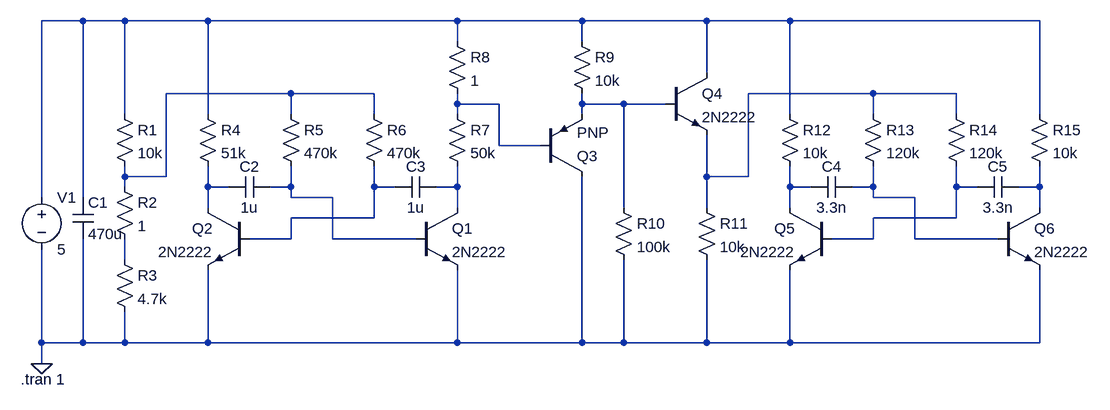
[diagram p0: schematic SimpleSynthesizer.asc]
SimpleSynthesizer.asc, the LTspice schematic file:
Version 4
SHEET 1 1784 680
WIRE 224 -80 160 -80
WIRE 288 -80 224 -80
WIRE 416 -80 288 -80
WIRE 800 -80 416 -80
WIRE 992 -80 800 -80
WIRE 1184 -80 992 -80
WIRE 1312 -80 1184 -80
WIRE 1696 -80 1312 -80
WIRE 800 -48 800 -80
WIRE 992 -48 992 -80
WIRE 1184 0 1184 -80
WIRE 544 32 352 32
WIRE 672 32 544 32
WIRE 1440 32 1248 32
WIRE 1568 32 1440 32
WIRE 800 48 800 32
WIRE 864 48 800 48
WIRE 992 48 992 32
WIRE 1056 48 992 48
WIRE 1120 48 1056 48
WIRE 288 64 288 -80
WIRE 416 64 416 -80
WIRE 544 64 544 32
WIRE 672 64 672 32
WIRE 800 64 800 48
WIRE 992 64 992 48
WIRE 1312 64 1312 -80
WIRE 1440 64 1440 32
WIRE 1568 64 1568 32
WIRE 1696 64 1696 -80
WIRE 864 112 864 48
WIRE 928 112 864 112
WIRE 288 160 288 144
WIRE 352 160 352 32
WIRE 352 160 288 160
WIRE 1184 160 1184 96
WIRE 1248 160 1248 32
WIRE 1248 160 1184 160
WIRE 288 176 288 160
WIRE 416 176 416 144
WIRE 448 176 416 176
WIRE 544 176 544 144
WIRE 544 176 512 176
WIRE 672 176 672 144
WIRE 704 176 672 176
WIRE 800 176 800 144
WIRE 800 176 768 176
WIRE 1312 176 1312 144
WIRE 1344 176 1312 176
WIRE 1440 176 1440 144
WIRE 1440 176 1408 176
WIRE 1568 176 1568 144
WIRE 1600 176 1568 176
WIRE 1696 176 1696 144
WIRE 1696 176 1664 176
WIRE 160 192 160 -80
WIRE 224 192 224 -80
WIRE 544 192 544 176
WIRE 608 192 544 192
WIRE 1440 192 1440 176
WIRE 1504 192 1440 192
WIRE 416 208 416 176
WIRE 800 208 800 176
WIRE 1056 208 1056 48
WIRE 1184 208 1184 160
WIRE 1312 208 1312 176
WIRE 1696 208 1696 176
WIRE 672 224 672 176
WIRE 672 224 544 224
WIRE 1568 224 1568 176
WIRE 1568 224 1440 224
WIRE 544 256 544 224
WIRE 544 256 480 256
WIRE 608 256 608 192
WIRE 736 256 608 256
WIRE 1440 256 1440 224
WIRE 1440 256 1376 256
WIRE 1504 256 1504 192
WIRE 1632 256 1504 256
WIRE 288 288 288 256
WIRE 160 416 160 272
WIRE 224 416 224 256
WIRE 224 416 160 416
WIRE 288 416 288 368
WIRE 288 416 224 416
WIRE 416 416 416 304
WIRE 416 416 288 416
WIRE 800 416 800 304
WIRE 800 416 416 416
WIRE 992 416 992 160
WIRE 992 416 800 416
WIRE 1056 416 1056 288
WIRE 1056 416 992 416
WIRE 1184 416 1184 288
WIRE 1184 416 1056 416
WIRE 1312 416 1312 304
WIRE 1312 416 1184 416
WIRE 1696 416 1696 304
WIRE 1696 416 1312 416
WIRE 160 448 160 416
FLAG 160 448 0
SYMBOL voltage 160 176 R0
WINDOW 123 0 0 Left 0
WINDOW 39 0 0 Left 0
SYMATTR InstName V1
SYMATTR Value 5
SYMBOL res 272 48 R0
SYMATTR InstName R1
SYMATTR Value 10k
SYMBOL res 272 160 R0
SYMATTR InstName R2
SYMATTR Value 1
SYMBOL res 272 272 R0
SYMATTR InstName R3
SYMATTR Value 4.7k
SYMBOL res 400 48 R0
SYMATTR InstName R4
SYMATTR Value 51k
SYMBOL res 528 48 R0
SYMATTR InstName R5
SYMATTR Value 470k
SYMBOL res 656 48 R0
SYMATTR InstName R6
SYMATTR Value 470k
SYMBOL cap 208 192 R0
SYMATTR InstName C1
SYMATTR Value 470u
SYMBOL cap 512 160 R90
WINDOW 0 0 32 VBottom 2
WINDOW 3 32 32 VTop 2
SYMATTR InstName C2
SYMATTR Value 1u
SYMBOL cap 768 160 R90
WINDOW 0 0 32 VBottom 2
WINDOW 3 32 32 VTop 2
SYMATTR InstName C3
SYMATTR Value 1u
SYMBOL npn 736 208 R0
SYMATTR InstName Q1
SYMATTR Value 2N2222
SYMBOL npn 480 208 M0
SYMATTR InstName Q2
SYMATTR Value 2N2222
SYMBOL res 784 48 R0
SYMATTR InstName R7
SYMATTR Value 50k
SYMBOL res 784 -64 R0
SYMATTR InstName R8
SYMATTR Value 1
SYMBOL pnp 928 160 M180
SYMATTR InstName Q3
SYMBOL res 976 -64 R0
SYMATTR InstName R9
SYMATTR Value 10k
SYMBOL npn 1120 0 R0
SYMATTR InstName Q4
SYMATTR Value 2N2222
SYMBOL res 1040 192 R0
SYMATTR InstName R10
SYMATTR Value 100k
SYMBOL res 1168 192 R0
SYMATTR InstName R11
SYMATTR Value 10k
SYMBOL npn 1376 208 M0
SYMATTR InstName Q5
SYMATTR Value 2N2222
SYMBOL res 1296 48 R0
SYMATTR InstName R12
SYMATTR Value 10k
SYMBOL res 1424 48 R0
SYMATTR InstName R13
SYMATTR Value 120k
SYMBOL res 1552 48 R0
SYMATTR InstName R14
SYMATTR Value 120k
SYMBOL res 1680 48 R0
SYMATTR InstName R15
SYMATTR Value 10k
SYMBOL cap 1408 160 R90
WINDOW 0 0 32 VBottom 2
WINDOW 3 32 32 VTop 2
SYMATTR InstName C4
SYMATTR Value 3.3n
SYMBOL cap 1664 160 R90
WINDOW 0 0 32 VBottom 2
WINDOW 3 32 32 VTop 2
SYMATTR InstName C5
SYMATTR Value 3.3n
SYMBOL npn 1632 208 R0
SYMATTR InstName Q6
SYMATTR Value 2N2222
TEXT 128 472 Left 2 !.tran 1

The netlist it stands for:
* SimpleSynthesizer.asc
V1 N001 0 5
R1 N001 N002 10k
R2 N002 N014 1
R3 N014 0 4.7k
R4 N001 N006 51k
R5 N002 N007 470k
R6 N002 N008 470k
C1 N001 0 470u
C2 N007 N006 1u
C3 N009 N008 1u
Q1 N009 N007 0 0 2N2222
Q2 N006 N008 0 0 2N2222
R7 N004 N009 50k
R8 N001 N004 1
Q3 0 N004 N005 0 PNP
R9 N001 N005 10k
Q4 N001 N005 N003 0 2N2222
R10 N005 0 100k
R11 N003 0 10k
Q5 N010 N012 0 0 2N2222
R12 N001 N010 10k
R13 N003 N011 120k
R14 N003 N012 120k
R15 N001 N013 10k
C4 N011 N010 3.3n
C5 N013 N012 3.3n
Q6 N013 N011 0 0 2N2222
.model NPN NPN
.model PNP PNP
.lib standard.bjt
.tran 1
.backanno
.end